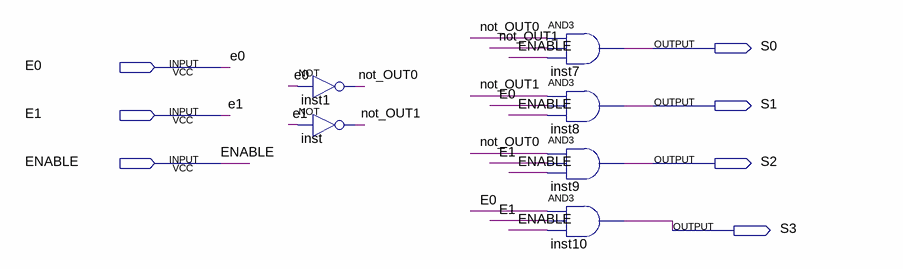
[diagram p0: schematic sheet]
// Quartus schematic DECODER_2X4_COM_ENABLE.bdf as structural Verilog: 6 symbols, 7 pins
module DECODER_2X4_COM_ENABLE (
  input  E0,
  input  E1,
  input  ENABLE,
  output S0,
  output S1,
  output S2,
  output S3
);

  wire not_OUT0, not_OUT1;

  not inst1 (not_OUT0, E0);
  not inst (not_OUT1, E1);
  and inst7 (S0, not_OUT0, not_OUT1, ENABLE);
  and inst8 (S1, not_OUT1, E0, ENABLE);
  and inst9 (S2, not_OUT0, E1, ENABLE);
  and inst10 (S3, E0, E1, ENABLE);
endmodule
